# Altium schematic sheet nRF24L01.SchDoc
size A4
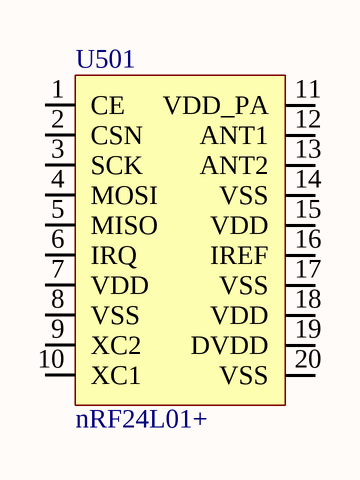
[diagram p0: nRF24L01.SchDoc]

## Parts
U501  nRF24L01+

## Nets

Not connected (* = marked no-connect by the designer): U501 1(CE) 2(CSN) 3(SCK) 4(MOSI) 5(MISO) 6(IRQ) 7(VDD) 8(VSS) 9(XC2) 10(XC1) 11(VDD_PA) 12(ANT1) 13(ANT2) 14(VSS) 15(VDD) 16(IREF) 17(VSS) 18(VDD) 19(DVDD) 20(VSS)